# Altium schematic sheet featherFet2.SchDoc
size 282 x 200 mm; COMPANY: ADAFRUIT INDUSTRIES; DRAWN: KTOWN; REV: B
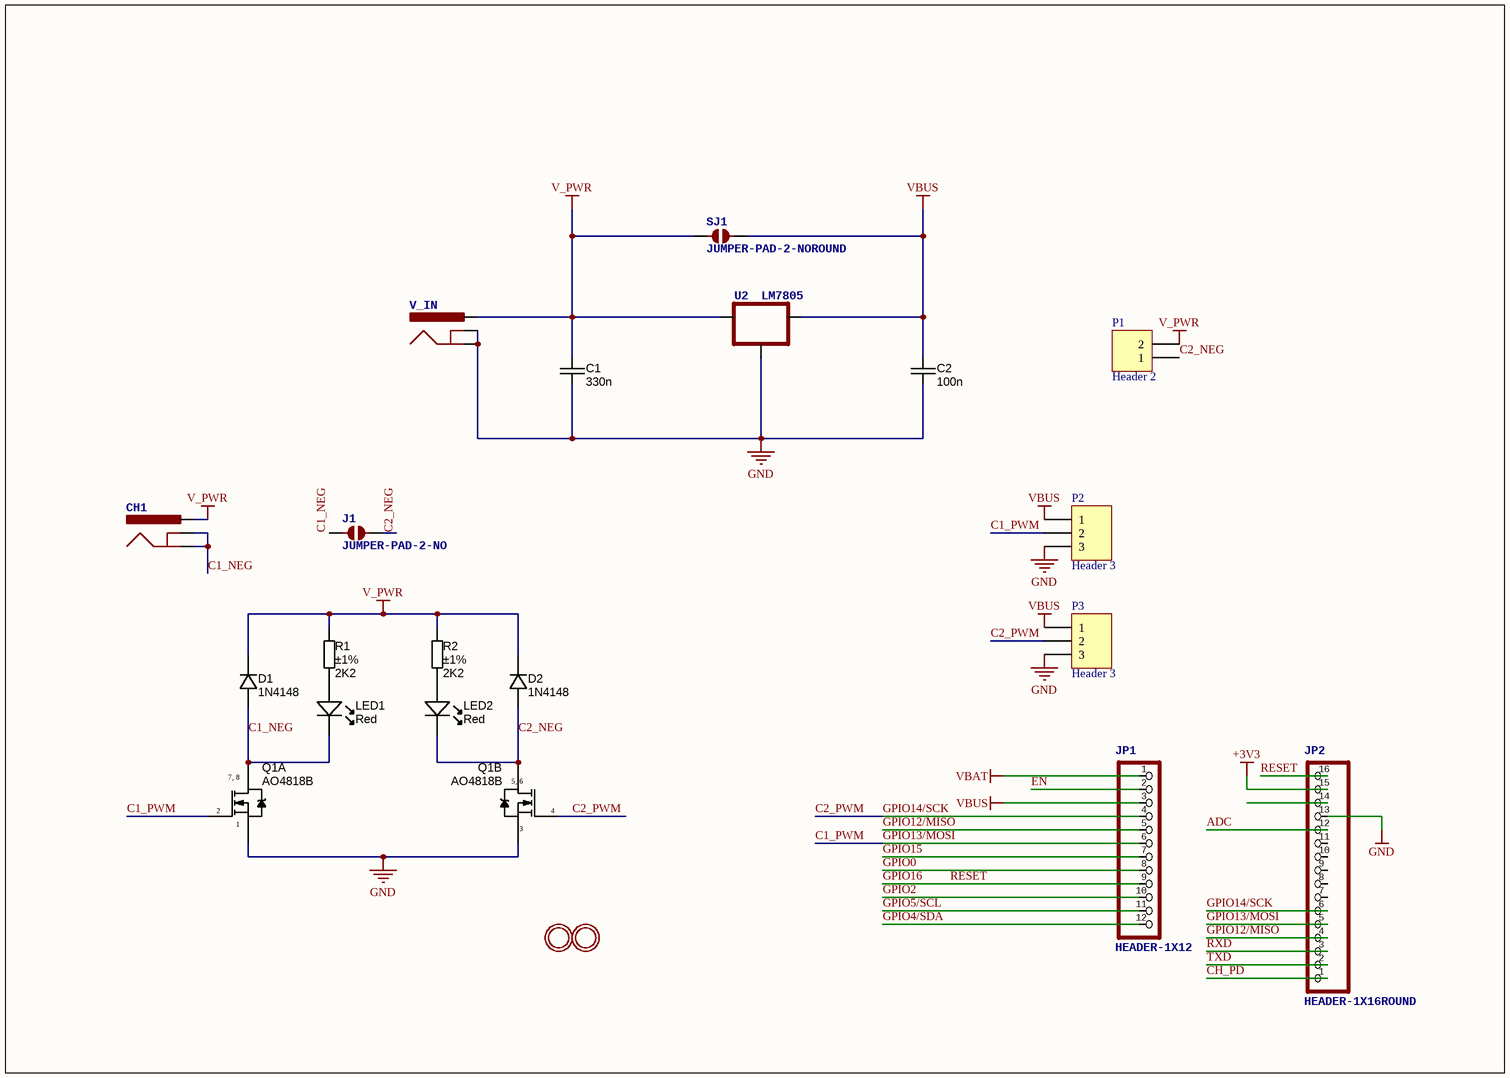
[diagram p0: featherFet2.SchDoc]

## Parts
C1  value 330n  [CAPC2012X135N]  (hidden comment: approved sub OK)
C2  value 100n  [CAPC2012X135N]  (hidden comment: approved sub OK)
CH1  Power JackThis is the standard 5.5mm barrel jack for power. The PTH is the most common, proven, reliable, footprint. The Slot footprint only works if the mill layer is transmitted to the PCB fab house so be warned. Mating wall wart : TOL-00298 (and others)  [POWER_JACK_PTH]  (value not drawn)
D1  1N4148  [SOD523F]
D2  1N4148  [SOD523F]
J1  JUMPER-PAD-2-NO  [PAD-JUMPER-2-NO_NO_SILK]
JP1  HEADER-1X12  [1X12_ROUND]
JP2  HEADER-1X16ROUND  [1X16_ROUND]
LED1  Color: Red  [LED-0805-K]
LED2  Color: Red  [LED-0805-K]
P1  Header 2  [HDR1X2]
P2  Header 3  [HDR1X3]
P3  Header 3  [HDR1X3]
Q1  Manufacturer Part Number 1: AO4818B  [SOIC127P600X175-8AN]  (hidden comment: MOSFET_AO4818B)  (parts A,B of 2)
R1  value 2K2  Tolerance: ±1%  [RESC2012X70N]  (hidden comment: Thick Film)
R2  value 2K2  Tolerance: ±1%  [RESC2012X70N]  (hidden comment: Thick Film)
SJ1  JUMPER-PAD-2-NOROUND  [PAD-JUMPER-2-NO_YES_SILK_ROUND]
U2  LM7805  [TO220-IGO]
U$31  MOUNTINGHOLE2.5  [MOUNTINGHOLE_2.5_PLATED]  (value not drawn)
U$32  MOUNTINGHOLE2.5  [MOUNTINGHOLE_2.5_PLATED]  (value not drawn)
V_IN  Power JackThis is the standard 5.5mm barrel jack for power. The PTH is the most common, proven, reliable, footprint. The Slot footprint only works if the mill layer is transmitted to the PCB fab house so be warned. Mating wall wart : TOL-00298 (and others)  [POWER_JACK_PTH]  (value not drawn)

## Nets
+3V3: JP2.15
GND: C1.2 C2.2 JP2.13 P2.3 P3.3 Q1.1(S) Q1.3(S) U2.GND V_IN.GND V_IN.GNDBREAK
V_PWR: C1.1 CH1.PWR D1.K D2.K P1.2 R1.1 R2.1 SJ1.1 U2.IN V_IN.PWR
VBAT: JP1.1
VBUS: C2.1 JP1.3 P2.1 P3.1 SJ1.2 U2.OUT
ADC: JP2.12
C1_NEG: CH1.GND CH1.GNDBREAK D1.A J1.1 LED1.K Q1.7(D) Q1.8(D)
C1_PWM: JP1.6 JP2.5 P2.2 Q1.2(G)  [also labelled GPIO13/MOSI]
C2_NEG: D2.A J1.2 LED2.K P1.1 Q1.5(D) Q1.6(D)
C2_PWM: JP1.4 JP2.6 P3.2 Q1.4(G)  [also labelled GPIO14/SCK]
CH_PD: JP2.1
EN: JP1.2
GPIO0: JP1.8
GPIO2: JP1.10
GPIO4/SDA: JP1.12
GPIO5/SCL: JP1.11
GPIO12/MISO: JP1.5 JP2.4
GPIO15: JP1.7
GPIO16: JP1.9 JP2.16  [also labelled RESET]
RXD: JP2.3
TXD: JP2.2
NetLED1_A: LED1.A R1.2
NetLED2_A: LED2.A R2.2

Not connected (* = marked no-connect by the designer): JP2 7 8 9 10 11 14

## Notes on the sheet
- (in symbol MOSFET_AO4818B, part A) 7, 8
- (in symbol MOSFET_AO4818B, part B) 5, 6

## Library data of the parts
C1 = CAPC_330n_0805_X7R_25V_10%: Capacitor SMD Cer 330nF 10% 25V X7R 0805; Manufacturer 1: Kemet; Manufacturer Part Number 1: C0805C334K3RACTU; Ratings: 25V; X7R; Material: ceramic; SCDType: spec; Package / Case: 0805 (2012 metric); Tolerance: ±10%; ComponentLink1URL: http://www.kemet.com/datasheets&C0805C334K3RACTU; ComponentLink1Description: http://www.kemet.com/datasheets&C0805C334K3RACTU; Supplier 1: Digi-Key; Supplier Part Number 1: 399-8071-1-ND
C2 = CAPC_100n_0805_X7R_50V_10%: Capacitor SMD Cer 100nF 10% 50V X7R 0805; Manufacturer 1: Kemet; Manufacturer Part Number 1: C0805C104K5RACTU; Ratings: 50V; X7R; Material: ceramic; SCDType: undef; Package / Case: 0805 (2012 metric); Tolerance: ±10%; Supplier 1: Digi-Key; Supplier Part Number 1: 399-1170-1-ND
CH1 V_IN = POWER_JACKPTH: PROD_ID: CONN-08197
D1 D2 = DIODE_1N4148_200mA_SOD523F: Diode SMD small signal 0.2A SOD-523F; Manufacturer 1: Fairchild Semiconductor; Manufacturer Part Number 1: 1N4148WT; Ratings: Vr=75V; Vf=1V@10mA; Io=200mA; Material: Si; SCDType: source; Package / Case: SC-79, SOD-523F; Supplier 1: Digi-Key; Supplier Part Number 1: 1N4148WTCT-ND; ComponentLink1URL: http://www.fairchildsemi.com/ds/1N/1N914BWT.pdf; ComponentLink1Description: http://www.fairchildsemi.com/ds/1N/1N914BWT.pdf; Value: 1N4148
JP1 = HEADER-1X12: COMPANY: ADAFRUIT INDUSTRIES; DRAWN: KTOWN; REV: B
JP2 = HEADER-1X16ROUND: PIN HEADER; COMPANY: ADAFRUIT INDUSTRIES; DRAWN: KTOWN; REV: B
LED1 LED2 = LED_SMD_Red_0805_6mcd: LED 0805 SMD Red 6mcd 621nm; Manufacturer 1: Lite-On Inc; Manufacturer Part Number 1: LTST-C171EKT; Material: GaAsP on GaP; Ratings: 6 mcd; 621 nm; SCDType: source; Package / Case: 0805; Supplier 1: Digi-Key; Supplier Part Number 1: 160-1422-1-ND; Value: Red
P1 = Header 2: Header, 2-Pin; LatestRevisionDate: 17-Jul-2002; LatestRevisionNote: Re-released for DXP Platform.; Publisher: Altium Limited
P2 P3 = Header 3: Header, 3-Pin; LatestRevisionDate: 17-Jul-2002; LatestRevisionNote: Re-released for DXP Platform.; Publisher: Altium Limited
Q1 = MOSFET_AO4818B: MOSFET Dual-Channel 30V 8.5A SOIC-8 SMD; Manufacturer 1: Alpha & Omega Semiconductor Inc; Ratings: 2W; 30V; 8.5A; 16 mOhm; Material: Silicon; SCDType: source; Package / Case: SOIC-8; Supplier 1: Digi-Key; Supplier Part Number 1: 785-1059-1-ND
R1 R2 = RES_2K2_0805_1%: Resistor SMD chip 2.2k Ohm 0.125W 1% 0805; Manufacturer 1: Vishay/Dale; Manufacturer Part Number 1: CRCW08052K20FKEA; Ratings: 1/8W; SCDType: spec; Supplier 1: Digi-Key; Supplier Part Number 1: 541-2.20KCCT-ND; Package / Case: 0805 (2012 metric)
U2 = V_REG_78XXSINK
U$31 U$32 = MOUNTINGHOLE2.5: Mounting Hole   For #2 screws (0.086"/2.18mm width, 0.094"/2.4mm hole) use 2.5mm; BOM: EXCLUDE; COMPANY: ADAFRUIT INDUSTRIES; DRAWN: KTOWN; REV: B